# EAGLE design Main (EAGLE 4.03)
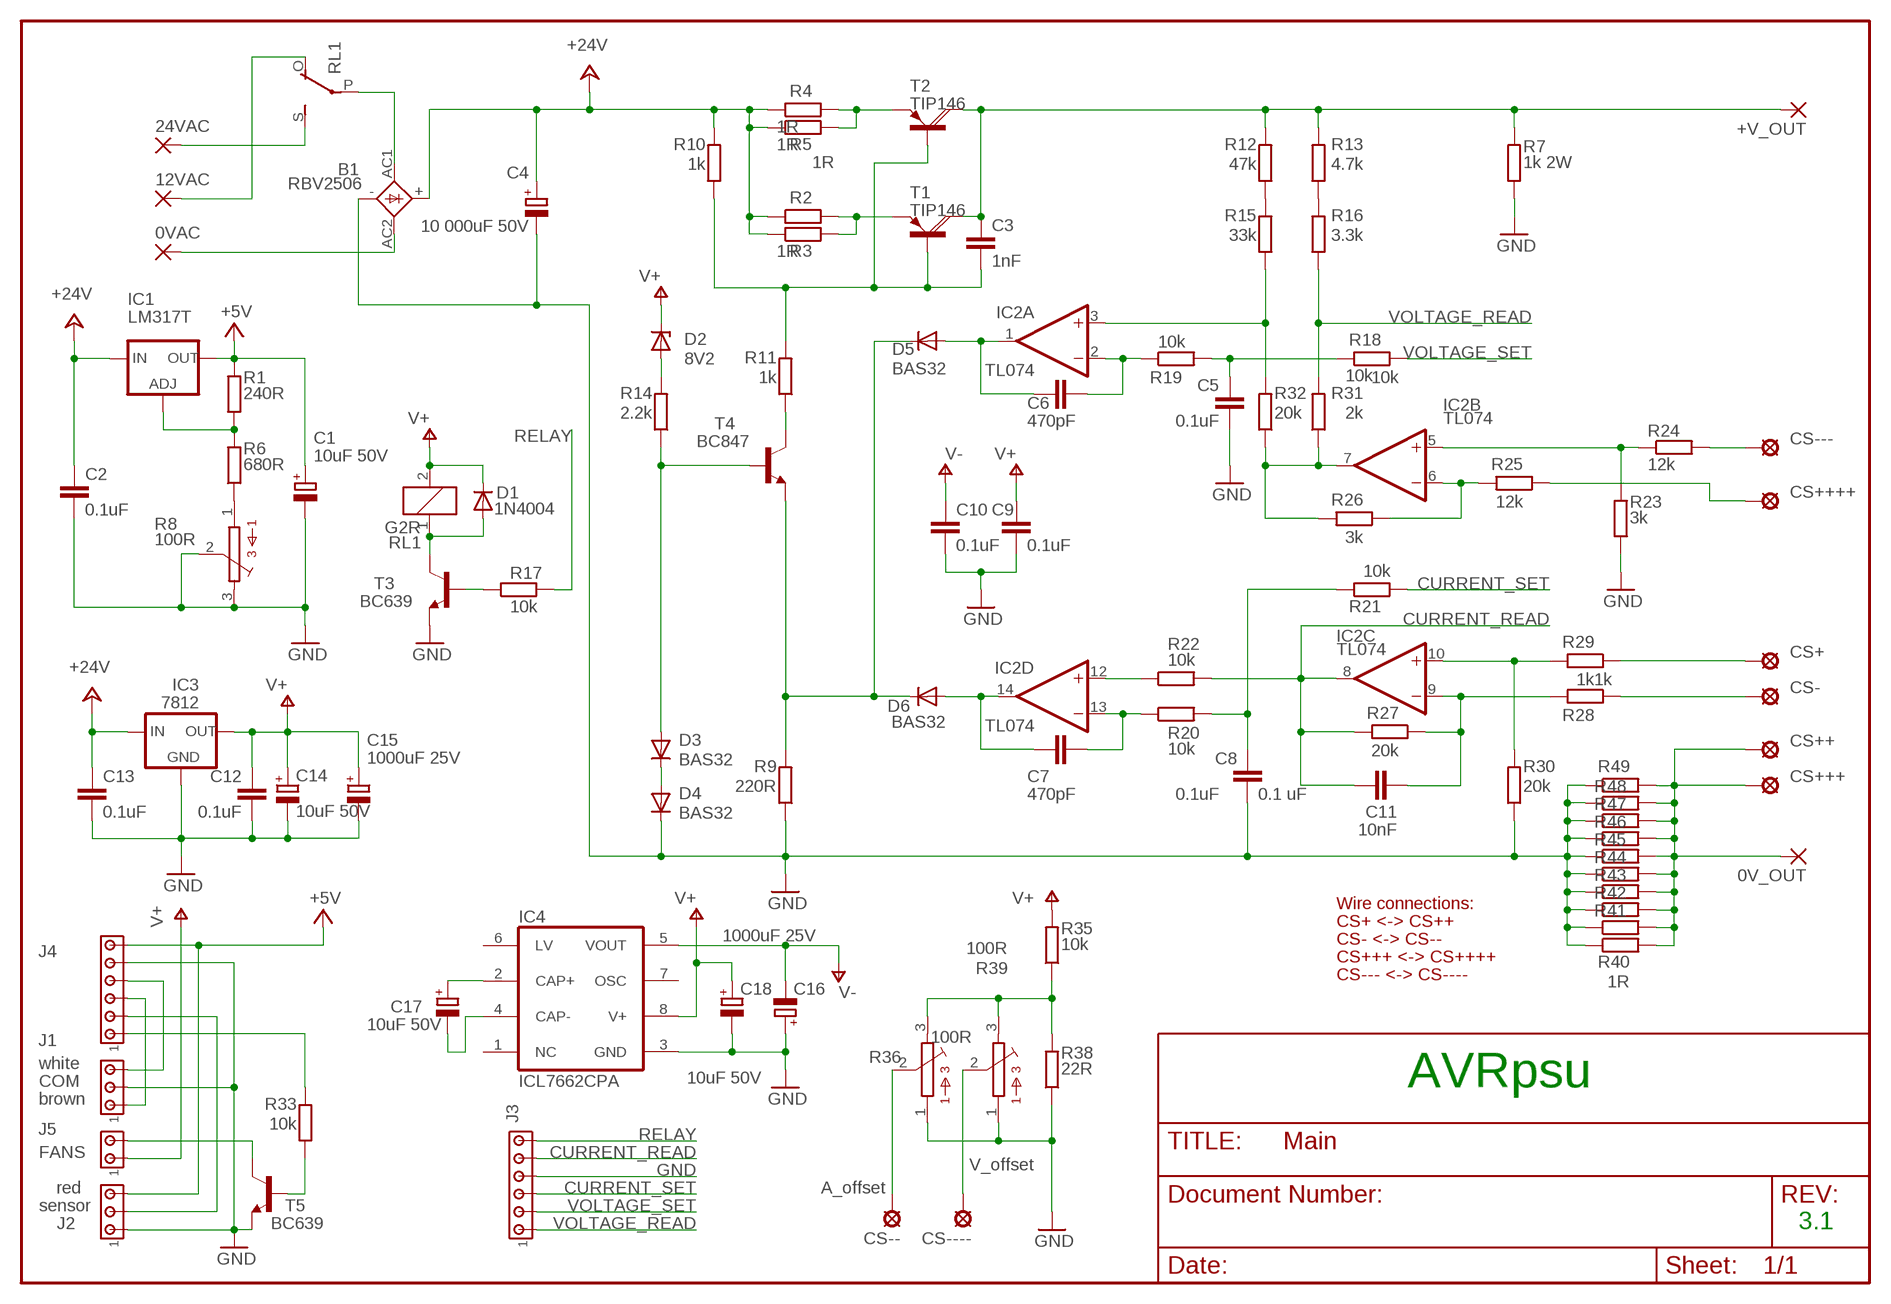
[diagram p0: schematic, sheet 1]

## Parts
0V_OUT  2,15/1,0  [2,15/1,0]
0VAC  2,15/1,0  [2,15/1,0]
12VAC  2,15/1,0  [2,15/1,0]
24VAC  2,15/1,0  [2,15/1,0]
+V_OUT  2,15/1,0  [2,15/1,0]
B1  RBV2506  FB32  [FB32]
C1  10uF 50V  CPOL-EUE5-5  [E5-5]
C2  0.1uF  C-EUC0805  [C0805]
C3  1nF  C-EUC0805  [C0805]
C4  10 000uF 50V  CPOL-EUE10-30  [EB30D]
C5  0.1uF  C-EUC0805  [C0805]
C6  470pF  C-EUC0805  [C0805]
C7  470pF  C-EUC0805  [C0805]
C8  0.1 uF  C-EUC0805  [C0805]
C9  0.1uF  C-EUC0805  [C0805]
C10  0.1uF  C-EUC0805  [C0805]
C11  10nF  C-EUC0805  [C0805]
C12  0.1uF  C-EUC0805  [C0805]
C13  0.1uF  C-EUC0805  [C0805]
C14  10uF 50V  CPOL-EUE5-5  [E5-5]
C15  1000uF 25V  CPOL-EUE5-13  [E5-13]
C16  1000uF 25V  CPOL-EUE5-13  [E5-13]
C17  10uF 50V  CPOL-EUE5-5  [E5-5]
C18  10uF 50V  CPOL-EUE5-5  [E5-5]
CS+  SMD  [SMD]
CS++  SMD  [SMD]
CS+++  SMD  [SMD]
CS++++  SMD  [SMD]
CS-  SMD  [SMD]
CS--  SMD  [SMD]
CS---  SMD  [SMD]
CS----  SMD  [SMD]
D1  1N4004  [DO41-10]
D2  8V2  ZENER-DIODESOD80C  [SOD80C]
D3  BAS32  DIODE-SOD80C  [SOD80C]
D4  BAS32  DIODE-SOD80C  [SOD80C]
D5  BAS32  DIODE-SOD80C  [SOD80C]
D6  BAS32  DIODE-SOD80C  [SOD80C]
IC1  LM317T  LM317TS  [317TS]
IC2  TL074  4AMP_P4+11D  [SO14]
IC3  7812  78XXL  [78XXL]
IC4  ICL7662CPA  ICL7660CPA  [DIL08]
J1  MTA03-100  [10X03MTA]
J2  MTA03-100  [10X03MTA]
J3  MTA06-100  [10X06MTA]
J4  MTA06-100  [10X06MTA]
J5  MTA02-100  [10X02MTA]
R1  240R  R-EU_R0805  [R0805]
R2  1R  R-EU_0207/10  [0207/10]
R3  1R  R-EU_0207/10  [0207/10]
R4  1R  R-EU_0207/10  [0207/10]
R5  1R  R-EU_0207/10  [0207/10]
R6  680R  R-EU_R0805  [R0805]
R7  1k 2W  R-EU_0414/15  [0414/15]
R8  100R  B64Y  [B64Y]
R9  220R  R-EU_R0805  [R0805]
R10  1k  R-EU_R0805  [R0805]
R11  1k  R-EU_R0805  [R0805]
R12  47k  R-EU_R0805  [R0805]
R13  4.7k  R-EU_R0805  [R0805]
R14  2.2k  R-EU_R0805  [R0805]
R15  33k  R-EU_R0805  [R0805]
R16  3.3k  R-EU_R0805  [R0805]
R17  10k  R-EU_0207/10  [0207/10]
R18  10k  R-EU_R0805  [R0805]
R19  10k  R-EU_R0805  [R0805]
R20  10k  R-EU_R0805  [R0805]
R21  10k  R-EU_R0805  [R0805]
R22  10k  R-EU_R0805  [R0805]
R23  3k  R-EU_R0805  [R0805]
R24  12k  R-EU_R0805  [R0805]
R25  12k  R-EU_R0805  [R0805]
R26  3k  R-EU_R0805  [R0805]
R27  20k  R-EU_R0805  [R0805]
R28  1k  R-EU_R0805  [R0805]
R29  1k  R-EU_R0805  [R0805]
R30  20k  R-EU_R0805  [R0805]
R31  2k  R-EU_R0805  [R0805]
R32  20k  R-EU_R0805  [R0805]
R33  10k  R-EU_0207/10  [0207/10]
R35  10k  R-EU_R0805  [R0805]
R36  100R  23B  [23B]
R38  22R  R-EU_R0805  [R0805]
R39  100R  23B  [23B]
R40  1R  R-EU_0207/10  [0207/10]
R41  R-EU_0207/10  [0207/10]
R42  R-EU_0207/10  [0207/10]
R43  R-EU_0207/10  [0207/10]
R44  R-EU_0207/10  [0207/10]
R45  R-EU_0207/10  [0207/10]
R46  R-EU_0207/10  [0207/10]
R47  R-EU_0207/10  [0207/10]
R48  R-EU_0207/10  [0207/10]
R49  R-EU_0207/10  [0207/10]
RL1  G2R  [G2R]
T1  TIP146  [TO218AV]
T2  TIP146  [TO218AV]
T3  BC639  [TO92]
T4  BC847  [SOT23]
T5  BC639  [TO92]

## Nets
+5V: C1.+ IC1.2(OUT) J2.3 J4.1 R1.2
+24V: B1.+ C2.2 C4.+ C13.2 IC1.3(IN) IC3.IN R2.1 R3.1 R4.1 R5.1 R10.2
CURRENT_READ: C11.2 IC2.8(C:OUT) J3.2 R22.2 R27.2
CURRENT_SET: J3.4 R21.2
FAN-: J5.2 T5.2(C)
GND: B1.- C1.- C2.1 C4.- C5.1 C8.1 C9.1 C10.1 C12.1 C13.1 C14.- C15.- C16.+ C18.- D4.C IC3.GND IC4.3(GND) J1.2 J2.1 J3.3 J4.2 R7.1 R8.2 R8.3 R9.1 R23.1 R30.1 R36.1 R38.1 R39.1 R40.1 R41.1 R42.1 R43.1 R44.1 R45.1 R46.1 R47.1 R48.1 R49.1 T3.3(E) T5.3(E)
N$1: 12VAC.1(P) RL1.O(2:O)
N$2: R6.1 R8.1
N$3: 0VAC.1(P) B1.AC2
N$4: C8.2 R20.2 R21.1
N$5: C5.2 R18.1 R19.2
N$6: B1.AC1 RL1.P(2:P)
N$7: +V_OUT.1(P) C3.2 R7.2 R12.2 R13.2 T1.C T2.C
N$8: R12.1 R15.2
N$10: C3.1 R10.1 R11.2 T1.B T2.B
N$11: IC2.7(B:OUT) R26.2 R31.1 R32.1
N$12: D3.A R14.1 T4.1(B)
N$13: R11.1 T4.3(C)
N$14: D5.C D6.C R9.2 T4.2(E)
N$15: D2.A R14.2
N$16: C7.1 IC2.13(D:-IN) R20.1
N$17: R35.1 R36.3 R38.2 R39.3
N$19: J4.6 R33.2
N$20: C11.1 IC2.9(C:-IN) R27.1 R28.2
N$21: CS----.P$1(MP) R39.2
N$22: IC2.6(B:-IN) R25.2 R26.1
N$24: 24VAC.1(P) RL1.S(2:S)
N$25: C7.2 D6.A IC2.14(D:OUT)
N$26: C6.2 D5.A IC2.1(A:OUT)
N$27: IC2.12(D:+IN) R22.1
N$28: C6.1 IC2.2(A:-IN) R19.1
N$29: R13.1 R16.2
N$30: 0V_OUT.1(P) CS+++.P$1(MP) CS++.P$1(MP) R40.2 R41.2 R42.2 R43.2 R44.2 R45.2 R46.2 R47.2 R48.2 R49.2
N$32: IC1.1(ADJ) R1.1 R6.2
N$33: D1.A RL1.1 T3.2(C)
N$34: IC2.10(C:+IN) R29.2 R30.2
N$35: D3.C D4.A
N$37: IC2.5(B:+IN) R23.2 R24.1
N$39: R4.2 R5.2 T2.E
N$42: R17.1 T3.1(B)
N$43: R2.2 R3.2 T1.E
N$45: C17.+ IC4.2(CAP+)
N$46: C17.- IC4.4(CAP-)
N$47: CS-.P$1(MP) R28.1
N$50: IC2.3(A:+IN) R15.1 R32.2
N$51: R33.1 T5.1(B)
N$52: CS+.P$1(MP) R29.1
N$53: CS++++.P$1(MP) R25.1
N$54: CS---.P$1(MP) R24.2
N$56: CS--.P$1(MP) R36.2
RELAY: J3.1 R17.2
RS232_IN: J1.3 J4.3
RS232_OUT: J1.1 J4.4
T_SIG: J2.2 J4.5
V+: C9.2 C12.2 C14.+ C15.+ C18.+ D1.C D2.C IC3.OUT IC4.8(V+) J5.1 R35.2 RL1.2
V-: C10.2 C16.- IC4.5(VOUT)
VOLTAGE_READ: J3.6 R16.1 R31.2
VOLTAGE_SET: J3.5 R18.2
Unconnected: IC4.1(NC) IC4.6(LV) IC4.7(OSC)

## Notes on the sheet
- Wire connections:
- CS+ <-> CS++
- CS- <-> CS--
- CS+++ <-> CS++++
- CS--- <-> CS----
- white
- COM | AVRpsu
- brown
- FANS | V_offset
- red | A_offset
- sensor
- 3.1

## Power pins joined to a net without a drawn wire
V+: IC2.4(P:V+)
V-: IC2.11(P:V-)

## Library data of the parts
0V_OUT 0VAC 12VAC 24VAC +V_OUT = wirepad:2,15/1,0: THROUGH-HOLE PAD
B1 = rectifier:FB32: FAGOR RECTIFIER grid 1 x 10,2 x 7,5 mm
C1 C4 C14-C18 = rcl:CPOL-EU: POLARIZED CAPACITOR, European symbol
C2 C3 C5-C13 = rcl:C-EU: CAPACITOR, European symbol
CS+ CS++ CS+++ CS++++ CS- CS-- CS--- CS---- = solpad:SMD: SOLDER PAD SMD solder pad
D1 = diode:1N4004: DIODE general purpose rectifier, 1 A
D2 = diode:ZENER-DIODE: Z-Diode
D3-D6 = diode:DIODE-: DIODE
IC1 = v-reg:LM317TS: VOLTAGE REGULATOR
IC2 = linear:4AMP_P4+11: OP AMP
IC3 = v-reg:78XXL: VOLTAGE REGULATOR
IC4 = maxim:ICL7660CPA: VOLTAGE CONVERTER
J1 J2 = con-amp:MTA03-100: AMP CONNECTOR
J3 J4 = con-amp:MTA06-100: AMP CONNECTOR
J5 = con-amp:MTA02-100: AMP CONNECTOR
R1-R7 R9-R33 R35 R38 R40-R49 = rcl:R-EU_: RESISTOR, European symbol
R8 = pot:B64Y: POTENTIOMETER
R36 R39 = pot:23B: POTENTIOMETER BI Technologies trimmer
RL1 = relay:G2R: RELAY 1 x switch, Omron
T1 T2 = transistor-power:TIP146: PNP DARLINGTON TRANSISTOR
T3 T5 = transistor-npn:BC639: NPN TRANSISTOR
T4 = transistor-npn:BC847: NPN TRANSISTOR

## Board
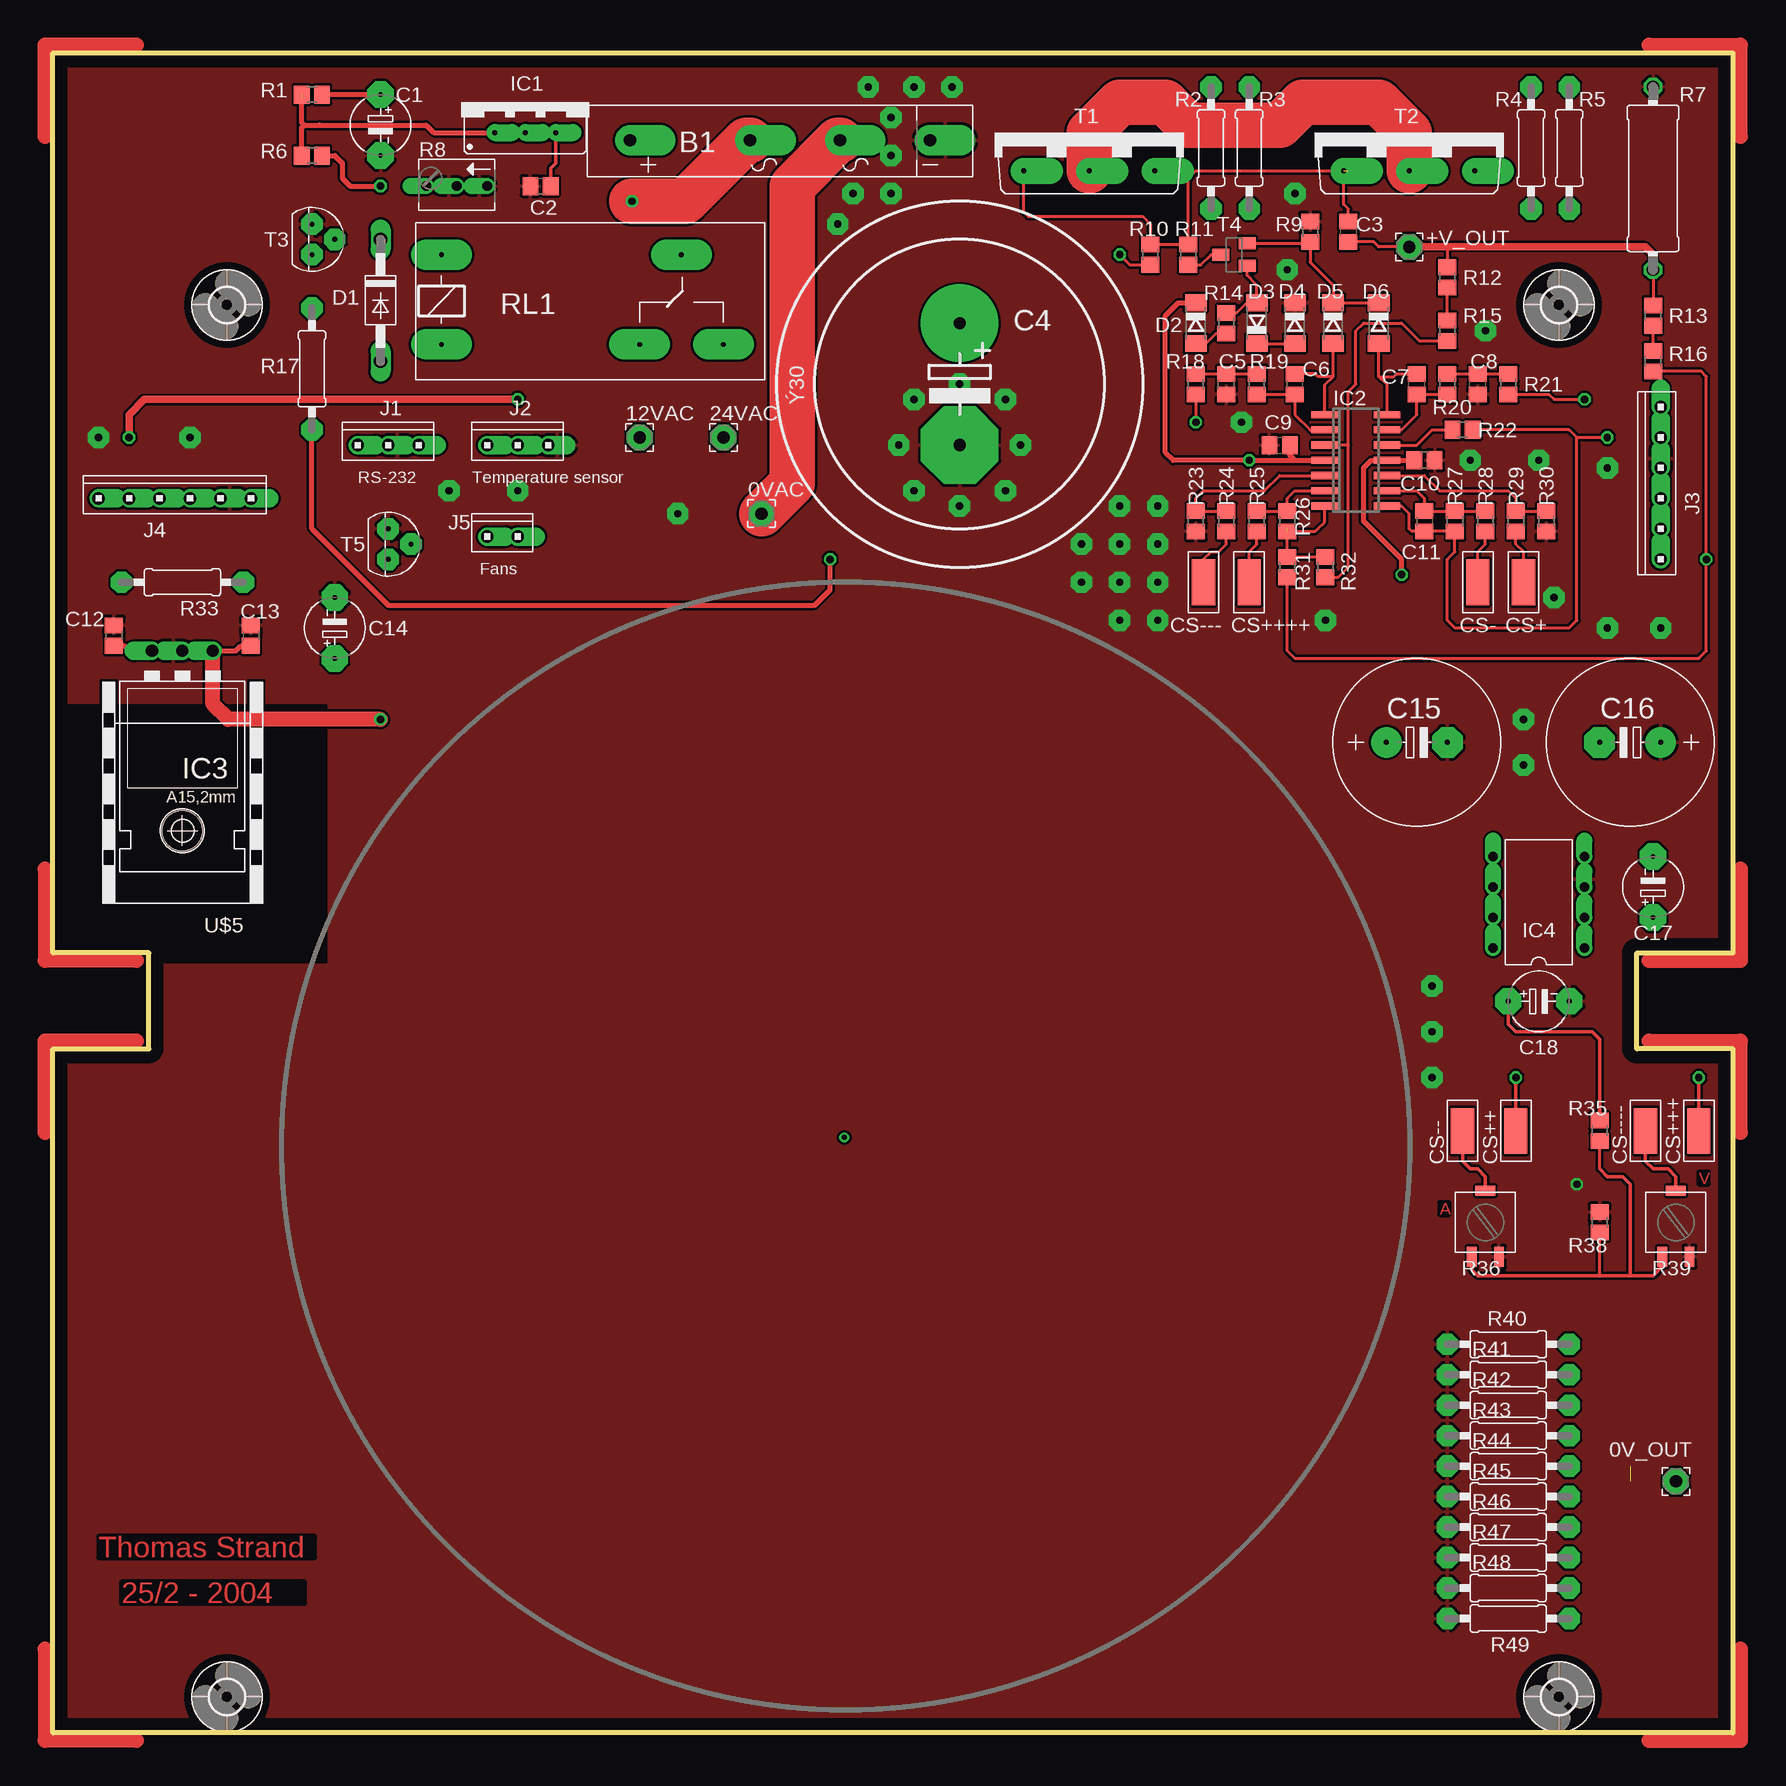
[diagram p1: board, top side]
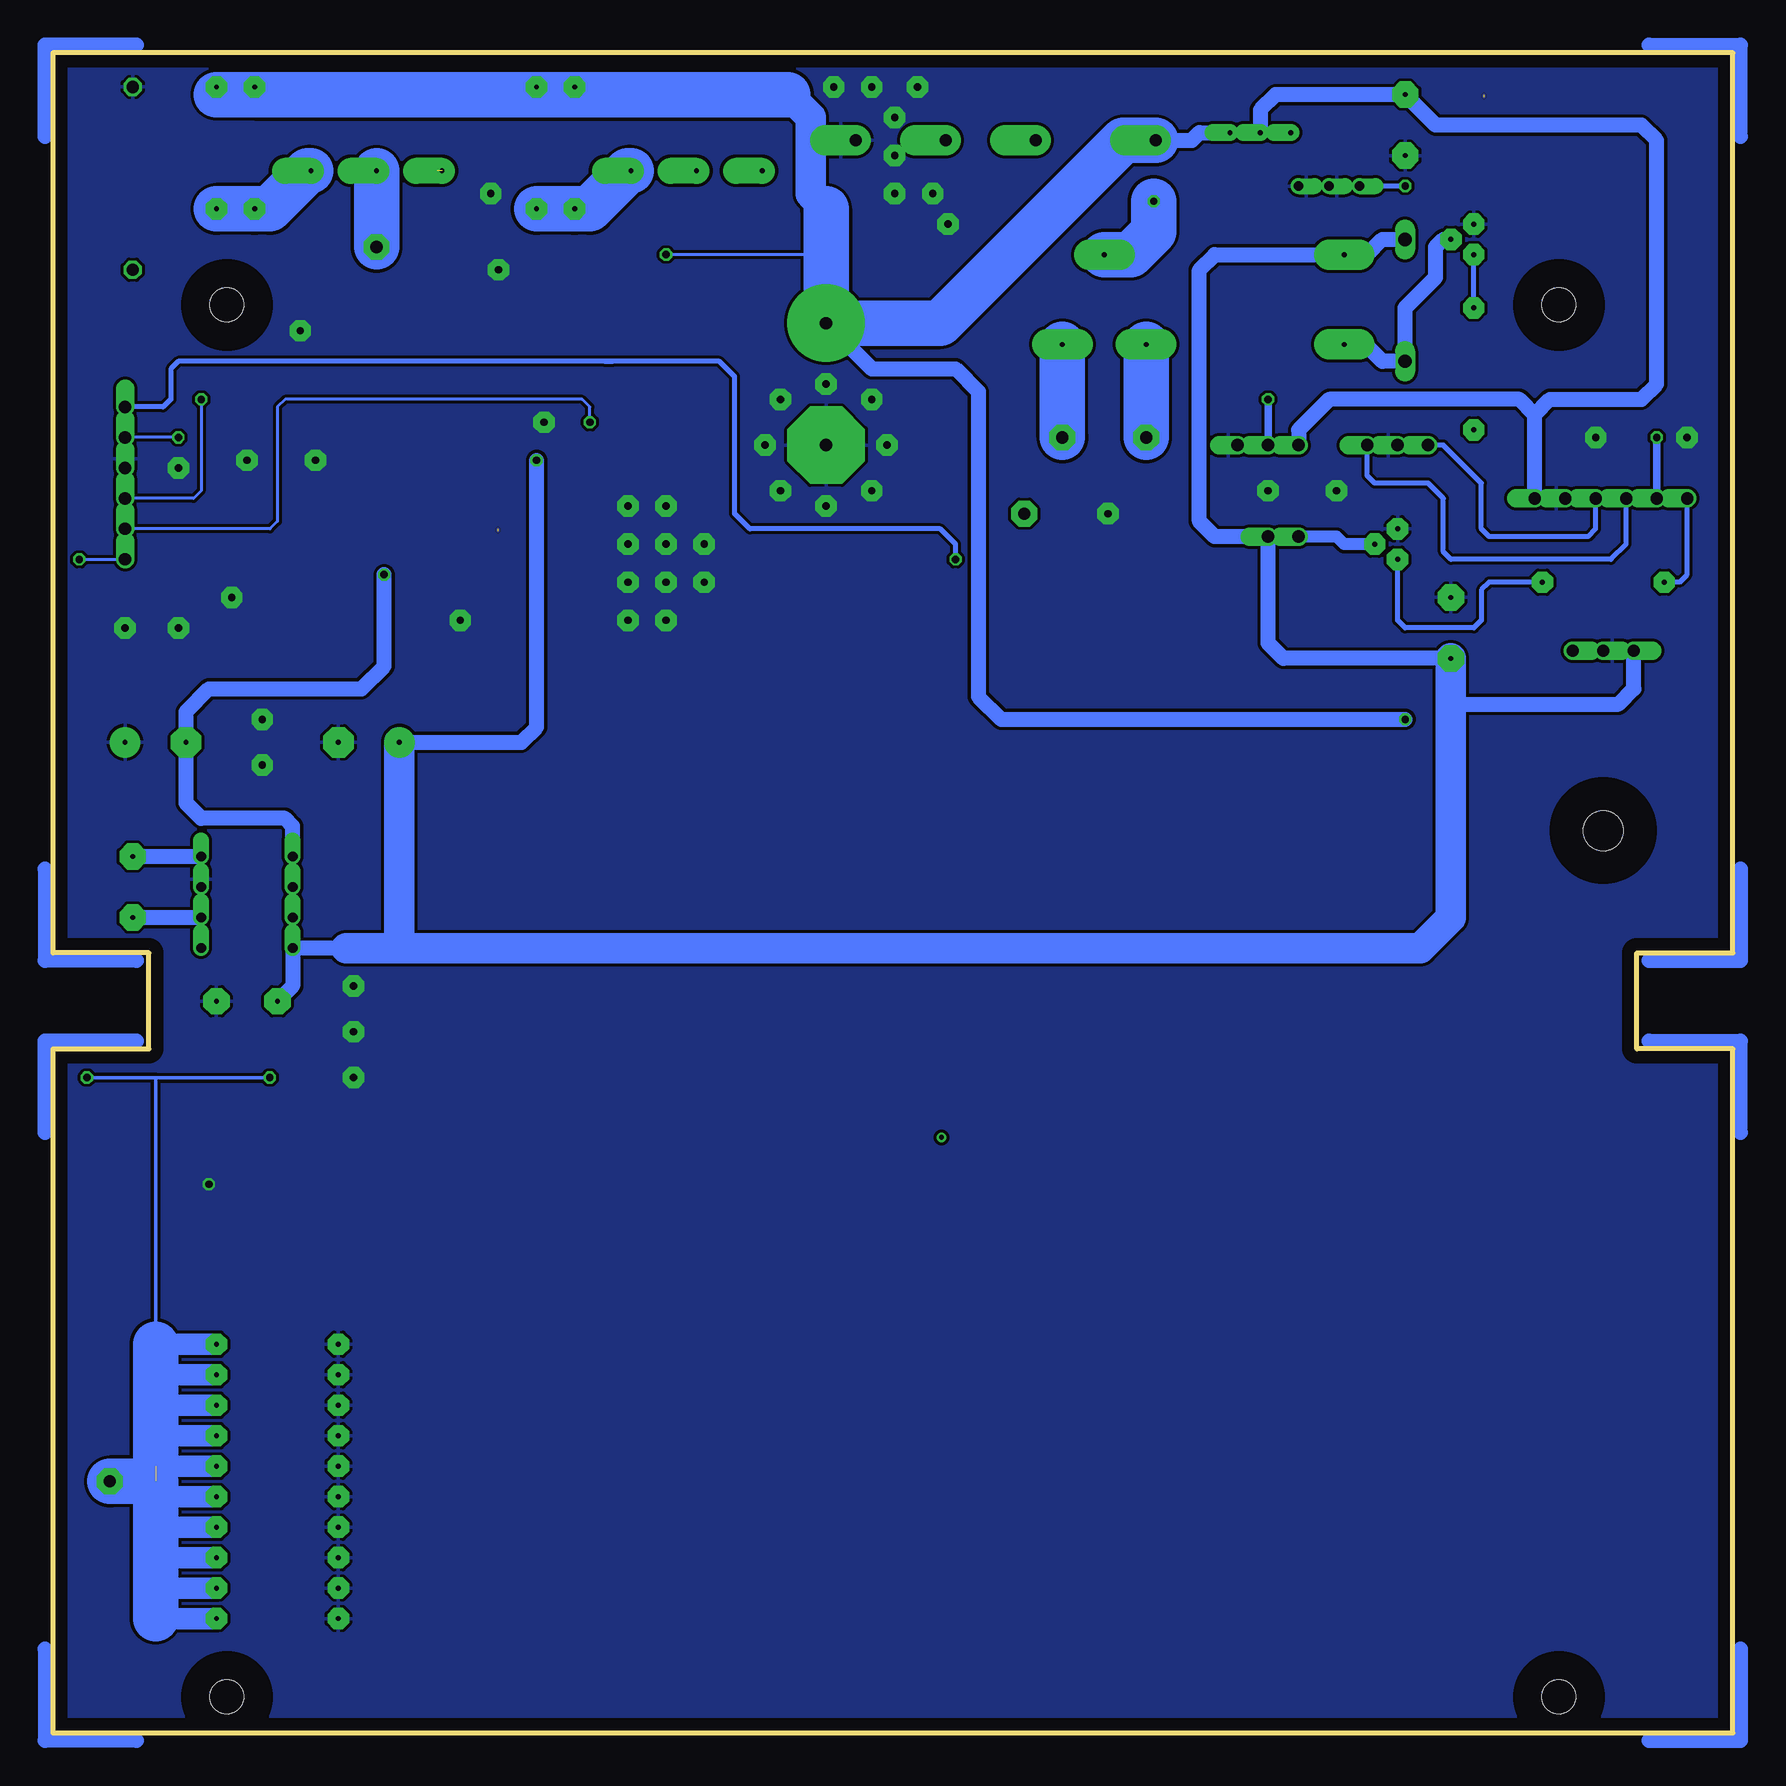
[diagram p2: board, bottom side, seen from below]

Size 140 x 140 mm. Coordinates in mm from the lower left corner, seen from the top.
Outline: 0,0 0,57 8,57 8,65 0,65 0,140 140,140 140,65 132,65 132,57 140,57 140,0 0,0
Copper layers used: Top, Bottom
tRestrict: area 0,64.1 to 22.9,85.7

### Footprints (pad centres in the part's own frame; a part is rotated, then mirrored left to right if it is on the bottom)
2,15/1,0 = drill 1.016 pad 2.159 octagon: 1 0,0
FB32 = drill 1.016 pad 2.54 offset: + -13.5,0; - 11.494,0; AC1 -3.492,0; AC2 4.001,0
E5-5 = drill 0.406 pad 2.184 octagon: + -2.54,0; - 2.54,0
C0805 = smd 1.3 x 1.5: 1 -0.85,0; 2 0.85,0
EB30D = drill 1.016 pad 6.452 round: + -5.08,0 | drill 1.016 pad 6.452 octagon: - 5.08,0
E5-13 = drill 0.406 pad 2.54 round: + -2.54,0 | drill 0.406 pad 2.54 octagon: - 2.54,0
SMD = smd 3.81 x 1.93: P$1 0,0
DO41-10 = drill 1.118 long: A 5.08,0; C -5.08,0
SOD80C = smd 1.4 x 1.8: A 1.7,0; C -1.7,0
317TS = drill 0.406 pad 1.422 offset: 1 -2.54,-2.54; 2 0,-2.54; 3 2.54,-2.54
SO14 = smd 0.6 x 2.2: 1 -3.81,-2.6; 2 -2.54,-2.6; 3 -1.27,-2.6; 4 0,-2.6; 5 1.27,-2.6; 6 2.54,-2.6; 7 3.81,-2.6; 8 3.81,2.6; 9 2.54,2.6; 10 1.27,2.6; 11 0,2.6; 12 -1.27,2.6; 13 -2.54,2.6; 14 -3.81,2.6
78XXL = drill 1.016 offset: GND 0,-3.81; IN -2.54,-3.81; OUT 2.54,-3.81 | hole 3.302: 0,11.176
DIL08 = drill 0.813 offset: 1 -3.81,-3.81; 2 -1.27,-3.81; 3 1.27,-3.81; 4 3.81,-3.81; 5 3.81,3.81; 6 1.27,3.81; 7 -1.27,3.81; 8 -3.81,3.81
10X03MTA = drill 1.016 offset: 1 2.54,0; 2 0,0; 3 -2.54,0
10X06MTA = drill 1.016 offset: 1 6.35,0; 2 3.81,0; 3 1.27,0; 4 -1.27,0; 5 -3.81,0; 6 -6.35,0
10X02MTA = drill 1.016 offset: 1 1.27,0; 2 -1.27,0
R0805 = smd 1.3 x 1.5: 1 -0.85,0; 2 0.85,0
0207/10 = drill 0.406 pad 1.778 octagon: 1 -5.08,0; 2 5.08,0
0414/15 = drill 1.016 octagon: 1 -7.62,0; 2 7.62,0
B64Y = drill 0.813 offset: 1 2.54,0; 2 0,0; 3 -2.54,0
23B = smd 0.813 x 1.676: 1 1.13,-2.87; 3 -1.13,-2.87 | smd 1.676 x 0.813: 2 0,2.64
G2R = drill 0.406 pad 2.54 long: 1 -2.54,-3.683; 2 -2.54,3.81; O 13.97,-3.683; P 17.45,3.81; S 20.955,-3.683
TO218AV = drill 0.406 pad 2.184 offset: B -5.461,-3.175; C 0,-3.175; E 5.461,-3.175
TO92 = drill 0.406 pad 1.778 octagon: 1 1.27,0; 2 0,1.905; 3 -1.27,0
SOT23 = smd 1 x 1.4: 1 -0.95,-1.1; 2 0.95,-1.1; 3 0,1.1
2,8 = hole 2.8: 0,0

### Placement (x,y rotation side)
0V_OUT  135.25,20.95 0 top
0VAC  59.05,101.6 0 top
12VAC  48.9,107.95 0 top
24VAC  55.88,107.95 0 top
+V_OUT  113.03,123.83 0 top
B1  61.59,132.72 0 top
C1  27.3,133.99 270 top
C2  40.64,128.91 0 top
C3  107.95,125.09 270 top
C4  75.56,112.39 270 top
C5  97.79,112.39 90 top
C6  103.5,112.39 90 top
C7  113.67,112.39 90 top
C8  118.75,112.39 90 top
C9  102.23,107.31 0 top
C10  114.3,106.05 180 top
C11  114.3,100.97 270 top
C12  5.08,91.44 270 top
C13  16.51,91.44 270 top
C14  23.5,92.08 90 top
C15  113.67,82.55 0 top
C16  131.44,82.55 180 top
C17  133.35,70.48 90 top
C18  123.83,60.96 0 top
CS+  122.56,95.89 90 top
CS++  121.92,50.16 90 top
CS+++  137.16,50.16 90 top
CS++++  99.69,95.89 270 top
CS-  118.75,95.89 90 top
CS--  117.47,50.16 90 top
CS---  95.89,95.89 90 top
CS----  132.72,50.16 90 top
D1  27.3,119.38 270 top
D2  95.25,117.47 270 top
D3  100.33,117.47 90 top
D4  103.5,117.47 270 top
D5  106.68,117.47 270 top
D6  110.49,117.47 270 top
IC1  39.37,135.89 0 top
IC2  108.58,106.05 270 top
IC3  10.79,86.36 180 top
IC4  123.83,69.22 90 top
J1  27.94,107.31 0 top
J2  38.73,107.31 0 top
J3  133.99,104.14 90 top
J4  10.16,102.87 0 top
J5  37.47,99.69 0 top
R1  21.59,136.53 0 top
R2  96.52,132.08 270 top
R3  99.69,132.08 270 top
R4  123.19,132.08 270 top
R5  126.36,132.08 270 top
R6  21.59,131.44 180 top
R7  133.35,129.54 270 top
R8  33.66,128.91 180 top
R9  104.78,125.09 270 top
R10  91.44,123.19 270 top
R11  94.61,123.19 90 top
R12  116.2,121.28 90 top
R13  133.35,118.11 90 top
R14  97.79,117.47 270 top
R15  116.2,116.84 90 top
R16  133.35,114.3 90 top
R17  21.59,113.67 270 top
R18  95.25,112.39 270 top
R19  100.33,112.39 90 top
R20  116.2,112.39 90 top
R21  121.28,112.39 270 top
R22  117.47,108.58 0 top
R23  95.25,100.97 90 top
R24  97.79,100.97 270 top
R25  100.33,100.97 90 top
R26  102.87,100.97 270 top
R27  116.84,100.97 270 top
R28  119.38,100.97 90 top
R29  121.92,100.97 90 top
R30  124.46,100.97 90 top
R31  102.87,97.16 270 top
R32  106.05,97.16 270 top
R33  10.79,95.89 180 top
R35  128.91,50.16 90 top
R36  119.38,42.55 0 top
R38  128.91,42.55 270 top
R39  135.25,42.55 0 top
R40  121.28,32.38 0 top
R41  121.28,29.84 0 top
R42  121.28,27.3 0 top
R43  121.28,24.77 0 top
R44  121.28,22.23 0 top
R45  121.28,19.68 0 top
R46  121.28,17.14 0 top
R47  121.28,14.61 0 top
R48  121.28,12.06 0 top
R49  121.28,9.53 0 top
RL1  34.92,119.38 0 top
T1  86.36,133.35 0 top
T2  113.03,133.35 0 top
T3  21.59,124.46 270 top
T4  98.42,123.19 90 top
T5  27.94,99.06 270 top
U$1  [ANGLE-ARROW-SE1-16]  0,140 180 top
U$2  [ANGLE-ARROW-SE1-16]  140,140 90 top
U$3  [2,8]  14.5,119 0 top
U$4  [2,8]  125.5,119 0 top
U$5  [D02A-L]  10.79,80.64 90 top
U$6  [ANGLE-ARROW-SE1-16]  0,65 270 top
U$7  [ANGLE-ARROW-SE1-16]  140,65 0 top
U$8  [ANGLE-ARROW-SE1-16]  0,57 180 top
U$9  [ANGLE-ARROW-SE1-16]  140,57 90 top
U$10  [2,8]  14.5,3 0 top
U$11  [2,8]  125.5,3 0 top
U$12  [ANGLE-ARROW-SE1-16]  0,0 270 top
U$13  [ANGLE-ARROW-SE1-16]  140,0 0 top

### Tracks (layer width: path | path; a pad name or v marks a point on that pad's centre or on a via)
+5V
  Top 0.406: C1.+ R1.2
  Bottom 1.27: IC1.2 39.37,135.25 38.1,136.53 C1.+ 24.77,133.99 7.62,133.99 6.35,132.72 6.35,112.39 7.62,111.12 15.24,111.12 16.51,109.86 | J4.1 16.51,109.86 | J2.3 36.2,108.58 33.66,111.12 17.78,111.12 16.51,109.86
+24V  (via drill 0.61)
  Top 0.254: R10.2 89.75,122.34 v88.9,123.19
  Top 0.305: IC1.3 41.91,130.81 41.49,130.39 C2.2
  Top 0.406: C13.2 15.66,90.59 15.24,90.17 IC3.IN
  Top 1.27: IC3.IN 13.34,85.72 14.61,84.45 v27.3,84.45
  Bottom 0.254: 75.56,123.19 v88.9,123.19
  Bottom 1.27: B1.+ 45.09,132.72 44.45,133.35 IC1.3 | C4.+ 71.75,113.67 64.77,113.67 62.87,111.76 62.87,86.36 60.96,84.45 v27.3,84.45 | 96.52,136.53 R2.1 | 99.69,136.53 R3.1 | 123.19,136.53 R4.1 | 126.36,136.53 R5.1
  Bottom 2.54: 78.74,136.53 76.83,134.62 76.83,128.27 75.56,127
  Bottom 3.81: B1.+ 50.8,132.72 66.04,117.47 C4.+ 75.56,123.19 75.56,127 | 126.36,136.53 123.19,136.53 99.69,136.53 96.52,136.53 78.74,136.53
CURRENT_READ  (via drill 0.61)
  Top 0.254: 127,107.95 v129.54,107.95 | 127,107.95 127,92.71 126.36,92.08 116.84,92.08 116.2,92.71 116.2,97.79 116.84,98.42 R27.2 114.52,100.11 114.3,100.33 C11.2 113.25,100.11 113.03,100.33 113.03,101.6 112.39,102.23 IC2.8 | R22.2 126.36,108.58 127,107.95
  Bottom 0.254: v129.54,107.95 J3.2
CURRENT_SET  (via drill 0.61)
  Top 0.254: v127.64,111.12 125.09,111.12 124.67,111.55 R21.2
  Bottom 0.254: J3.4 128.27,102.87 127.64,103.5 v127.64,111.12
FAN-
  Bottom 1.016: T5.2 32.38,99.06 33.02,99.69 J5.2
GND  (via drill 0.61, 0.61 pad 1.78)
  other vias: 106.05,92.71 133.99,92.08 129.54,92.08 99.06,109.22 3.81,107.95 11.43,107.95 33.02,103.5 52.07,101.6 38.73,103.5 67.94,137.16 69.85,134.62 69.85,131.44 69.85,128.27 66.67,128.27 88.9,102.23 92.08,102.23 85.72,99.06 88.9,99.06 92.08,99.06 85.72,95.89 88.9,95.89 92.08,95.89 129.54,105.41 118.11,106.05 123.83,106.05 125.09,94.61 119.38,116.84 102.87,121.92 103.5,128.27 127,45.72 114.94,58.42 114.94,54.61 114.94,62.23 122.56,80.64 122.56,84.45 71.75,137.16 74.93,137.16 65.41,125.73 71.75,111.12 70.48,107.31 71.75,103.5 92.08,92.71 80.64,107.31 75.56,112.39 88.9,92.71 79.38,111.12 75.56,102.23 79.38,103.5
  pour Top: 0,140.34 140.34,140.34 140.34,0 0,0
  pour Bottom (isolate 0.254): 0,140.34 139.7,140.34 139.7,-0.64 0,-0.64 0,139.7 3.17,139.7 3.17,140.34 4.45,140.34
N$1
  Bottom 3.81: 12VAC.1 RL1.O
N$2  (via drill 0.61)
  Top 0.406: v27.3,128.91 24.77,128.91 24.13,129.54 24.13,130.81 23.5,131.44 R6.1
  Bottom 0.406: v27.3,128.91 R8.1
N$3
  Top 3.81: 0VAC.1 61.59,104.14 61.59,128.91 65.41,132.72 B1.AC2
N$4
  Top 0.254: R20.2 118.53,113.25 118.75,113.03 C8.2 121.07,113.25 121.28,113.03 R21.1
N$5
  Top 0.254: 97.79,113.03 C5.2 | R19.2 98,113.25 97.79,113.03 | R18.1 97.58,113.25 97.79,113.03
N$6  (via drill 0.61)
  Top 3.81: B1.AC1 57.78,132.72 52.7,127.64 v48.26,127.64
  Bottom 3.81: RL1.P 50.16,123.19 48.26,125.09 v48.26,127.64
N$7
  Top 0.254: C3.2 110.07,124.25 110.49,123.83 +V_OUT.1 | 116.2,123.83 R12.2 | R7.2 R13.2
  Top 0.61: +V_OUT.1 116.2,123.83 132.72,123.83 133.35,123.19 R7.2
  Top 3.81: T2.C 113.03,133.35 110.49,135.89 104.14,135.89 102.23,133.99 94.61,133.99 92.71,135.89 88.9,135.89 86.36,133.35 T1.C
  Bottom 3.81: +V_OUT.1 T2.C
N$8
  Top 0.254: R15.2 R12.1
N$9  (via drill 0.41)
  other vias: 14.5,119
N$10  (1 unrouted)
  Top 0.254: C3.1 107.95,127 107.57,127.38 T2.B | T1.B 80.9,126.75 81.28,126.36 90.81,126.36 91.44,125.73 R10.1 | R10.1 91.44,123.83 | R10.1 94.4,124.04 94.61,123.83 R11.2 94.61,129.54 95.25,130.18 107.95,130.18
N$11  (1 unrouted)
  Top 0.254: IC2.7 105.98,100.91 105.41,100.33 105.19,100.11 R26.2 | 102.87,100.33 R31.1 105.83,98 106.05,97.79 R32.1
N$12
  Top 0.254: T4.1 99.53,121.45 100.33,120.65 D3.A 99.49,119.17 98.64,118.33 R14.1
N$13
  Top 0.254: T4.3 96.52,123.19 95.67,122.34 R11.1
N$14
  Top 0.254: 106.68,119.38 D5.C | D6.C 106.89,119.17 106.68,119.38 | T4.2 104.45,124.14 104.78,124.46 R9.2 104.78,122.56 106.68,120.65 106.68,119.38
N$15
  Top 0.254: R14.2 96.94,116.62 96.09,115.78 D2.A
N$16
  Top 0.254: IC2.13 112.39,108.58 113.67,109.86 C7.1 115.99,111.55 116.2,111.76 R20.1
N$17
  Top 0.254: 128.91,38.1 128.91,41.91 | 128.91,49.53 R35.1 128.91,46.99
  Top 0.305: 128.91,41.91 R38.2 | R36.3 118.25,38.59 118.75,38.1 128.91,38.1 131.44,38.1 | R39.3 134.12,38.88 133.35,38.1 131.44,38.1 | 128.91,46.99 129.54,46.35 130.81,46.35 131.44,45.72 131.44,38.1
N$19
  Bottom 0.406: J4.6 3.81,96.52 4.45,95.89 R33.2
N$20
  Top 0.254: IC2.9 113.67,103.5 114.3,102.87 C11.1 | C11.1 114.3,101.6 | C11.1 116.62,101.81 116.84,101.6 R27.1 119.17,101.81 119.38,101.6 R28.2
N$21
  Top 0.305: R39.2 135.25,46.35 134.62,46.99 133.35,46.99 132.72,47.62 CS----.P$1
N$22
  Top 0.254: IC2.6 103.5,103.5 102.87,102.87 R26.1 | R26.1 102.87,101.6 | R25.2 100.33,101.6 100.55,101.81 R26.1
N$23  (via drill 0.41)
  other vias: 10.79,75.18
N$24
  Bottom 3.81: 24VAC.1 RL1.S
N$25
  Top 0.254: IC2.14 111.19,112.33 110.49,113.03 | 110.49,113.03 D6.A | C7.2 111.97,113.25 111.76,113.03 110.49,113.03
N$26
  Top 0.254: 106.68,113.03 105.98,112.33 IC2.1 105.98,109.92 | 106.68,113.03 D5.A | C6.2 105.19,113.25 105.41,113.03 106.68,113.03
N$27
  Top 0.254: IC2.12 113.67,107.31 114.94,108.58 R22.1
N$28
  Top 0.254: IC2.2 104.78,108.58 103.5,109.86 C6.1 | C6.1 103.5,111.76 | R19.1 100.33,111.76 100.55,111.55 C6.1
N$29
  Top 0.254: R16.2 R13.1
N$30  (via drill 0.61)  (1 unrouted)
  Top 0.305: v121.92,54.61 CS++.P$1 | v137.16,54.61 CS+++.P$1
  Bottom 0.254: 131.44,19.68 130.81,20.32
  Bottom 0.305: 131.44,54.61 v121.92,54.61 | 131.44,54.61 v137.16,54.61 | 131.44,32.38 131.44,54.61
  Bottom 1.778: R49.2 131.44,9.53 | 131.44,12.06 R48.2 | 131.44,14.61 R47.2 | 131.44,17.14 R46.2 | 131.44,19.68 R45.2 | R44.2 131.44,22.23 | 131.44,24.77 R43.2 | 131.44,27.3 R42.2 | 131.44,29.84 R41.2 | 131.44,32.38 R40.2
  Bottom 3.81: 0V_OUT.1 131.44,20.95 131.44,19.68 131.44,17.14 131.44,14.61 131.44,12.06 131.44,9.53 | 131.44,22.23 131.44,24.77 131.44,27.3 131.44,29.84 131.44,32.38
N$32  (1 unrouted)
  Top 0.406: IC1.1 31.75,133.35 31.11,133.99 22.23,133.99 20.95,133.99 | 20.95,136.53 20.74,136.31 20.74,134.2 20.95,133.99 | R6.2 20.74,133.77 20.95,133.99
N$33
  Bottom 1.27: RL1.1 32.38,115.57 30.48,115.57 29.21,114.3 D1.A 27.3,118.75 24.77,121.28 24.77,123.83 24.13,124.46 T3.2
N$34
  Top 0.254: R30.2 124.46,101.6 124.25,101.81 R29.2 | IC2.10 114.3,104.78 115.57,103.5 121.28,103.5 121.92,102.87 R29.2 | R29.2 121.92,101.6
N$35
  Top 0.254: D4.A 103.5,115.57 103.3,115.78 D3.C
N$36  (via drill 0.41)
  other vias: 125.5,119
N$37
  Top 0.254: IC2.5 102.23,104.78 100.97,103.5 95.89,103.5 95.25,102.87 R23.2 95.25,101.6 95.47,101.81 R24.1
N$38  (via drill 0.41)
  other vias: 125.5,3
N$39
  Bottom 3.81: R5.2 R4.2 121.92,127 118.75,130.18 T2.E
N$40  (via drill 0.41)
  other vias: 14.5,3
N$41  (via drill 0.41)
  other vias: 65.95,49.62
N$42
  Bottom 0.406: R17.1 T3.1
N$43
  Bottom 3.81: R3.2 R2.2 95.25,127 92.08,130.18 T1.E
N$45
  Bottom 1.27: IC4.2 C17.+
N$46
  Bottom 1.27: IC4.4 C17.-
N$47
  Top 0.254: R28.1 119.38,99.06 118.75,98.42 CS-.P$1
N$50
  Top 0.254: R32.2 107.1,96.31 107.95,97.16 107.95,107.31 | R15.1 113.88,115.99 112.39,117.47 109.22,117.47 108.58,116.84 108.58,112.39 107.95,111.76 107.95,107.31 | 107.95,107.31 IC2.3
N$51
  Bottom 0.406: R33.1 20.32,95.89 20.95,95.25 20.95,92.71 21.59,92.08 27.3,92.08 27.94,92.71 T5.1
N$52
  Top 0.254: R29.1 121.92,99.06 122.56,98.42 CS+.P$1
N$53
  Top 0.254: R25.1 100.33,99.06 99.69,98.42 CS++++.P$1
N$54
  Top 0.254: R24.2 97.79,99.06 97.16,98.42 96.52,98.42 95.89,97.79 CS---.P$1
N$56
  Top 0.305: R36.2 119.38,46.35 118.75,46.99 118.11,46.99 117.47,47.62 CS--.P$1
RELAY  (via drill 0.61)
  Top 0.406: R17.2 21.59,100.33 27.94,93.98 63.5,93.98 64.77,95.25 v64.77,97.79
  Bottom 0.406: J3.1 130.81,110.49 130.18,111.12 130.18,113.67 129.54,114.3 93.98,114.3 | 93.98,114.3 93.34,114.3 | v64.77,97.79 64.77,99.06 66.04,100.33 81.92,100.33 83.19,101.6 83.19,113.03 84.45,114.3 93.98,114.3
RS232_IN
  Bottom 0.406: J4.3 11.43,100.33 12.06,99.69 20.32,99.69 20.95,100.33 20.95,104.14 24.13,107.31 J1.3
RS232_OUT
  Bottom 0.406: J1.1 30.48,104.78 29.84,104.14 25.4,104.14 24.13,102.87 24.13,98.42 23.5,97.79 10.16,97.79 8.89,99.06 J4.4
T_SIG  (via drill 0.61)
  Top 0.61: v38.73,111.12 7.62,111.12 6.35,109.86 v6.35,107.95
  Bottom 0.61: v38.73,111.12 J2.2 | J4.5 v6.35,107.95
V+  (via drill 0.61)
  Top 0.305: R35.2 128.91,57.78 128.27,58.42 121.92,58.42 121.28,59.05 C18.+
  Top 0.406: 103.5,106.05 v99.69,106.05 93.34,106.05 92.71,106.68 92.71,118.11 93.78,119.17 D2.C | 103.5,106.05 IC2.4 | C9.2 103.08,106.47 103.5,106.05 | C12.2 5.93,90.59 6.35,90.17 IC3.OUT
  Bottom 1.27: IC3.OUT 8.26,87 9.53,85.72 22.86,85.72 23.5,86.36 C14.+ 37.47,89.53 38.73,90.81 J5.1 43.18,99.69 44.45,100.97 44.45,121.92 43.18,123.19 RL1.2 30.48,123.19 29.21,124.46 D1.C | 115.57,65.41 IC4.8 120.02,62.23 C18.+ | C15.+ 100.97,82.55 99.69,83.82 v99.69,106.05
  Bottom 2.54: 111.12,65.41 26.04,65.41 23.5,67.94 C14.+ | 111.12,65.41 115.57,65.41 | 111.12,65.41 C15.+
V-  (via drill 0.61)
  Top 0.406: v112.39,96.52 112.39,97.79 109.22,100.97 109.22,105.41 109.86,106.05 IC2.11 C10.2
  Bottom 1.27: v112.39,96.52 112.39,88.9 114.3,87 127,87 128.91,85.09 C16.- 128.91,77.47 127.64,76.2 120.65,76.2 120.02,75.56 IC4.5
VOLTAGE_READ  (via drill 0.61)
  Top 0.254: R31.2 102.87,90.17 103.5,89.53 137.16,89.53 137.79,90.17 v137.79,97.79 137.79,113.03 137.38,113.45 R16.1
  Bottom 0.254: v137.79,97.79 J3.6
VOLTAGE_SET  (via drill 0.61)
  Top 0.254: R18.2 v95.25,109.22
  Bottom 0.254: J3.5 121.92,100.33 121.28,100.97 121.28,110.49 120.65,111.12 95.89,111.12 95.25,110.49 v95.25,109.22

### Text on the board
Top: V | A | Thomas Strand | 25/2 - 2004
tPlace: RS-232 | Temperature sensor | Fans
tNames: R36 | R39
Document: Relay | Current_read | Gnd | Current_set | Voltage_set | Voltage_read